# EasyEDA Pro project ADDA.eprj

# Schematic Schematic1
Board Name: Board1; Create Date: 2025-06-09
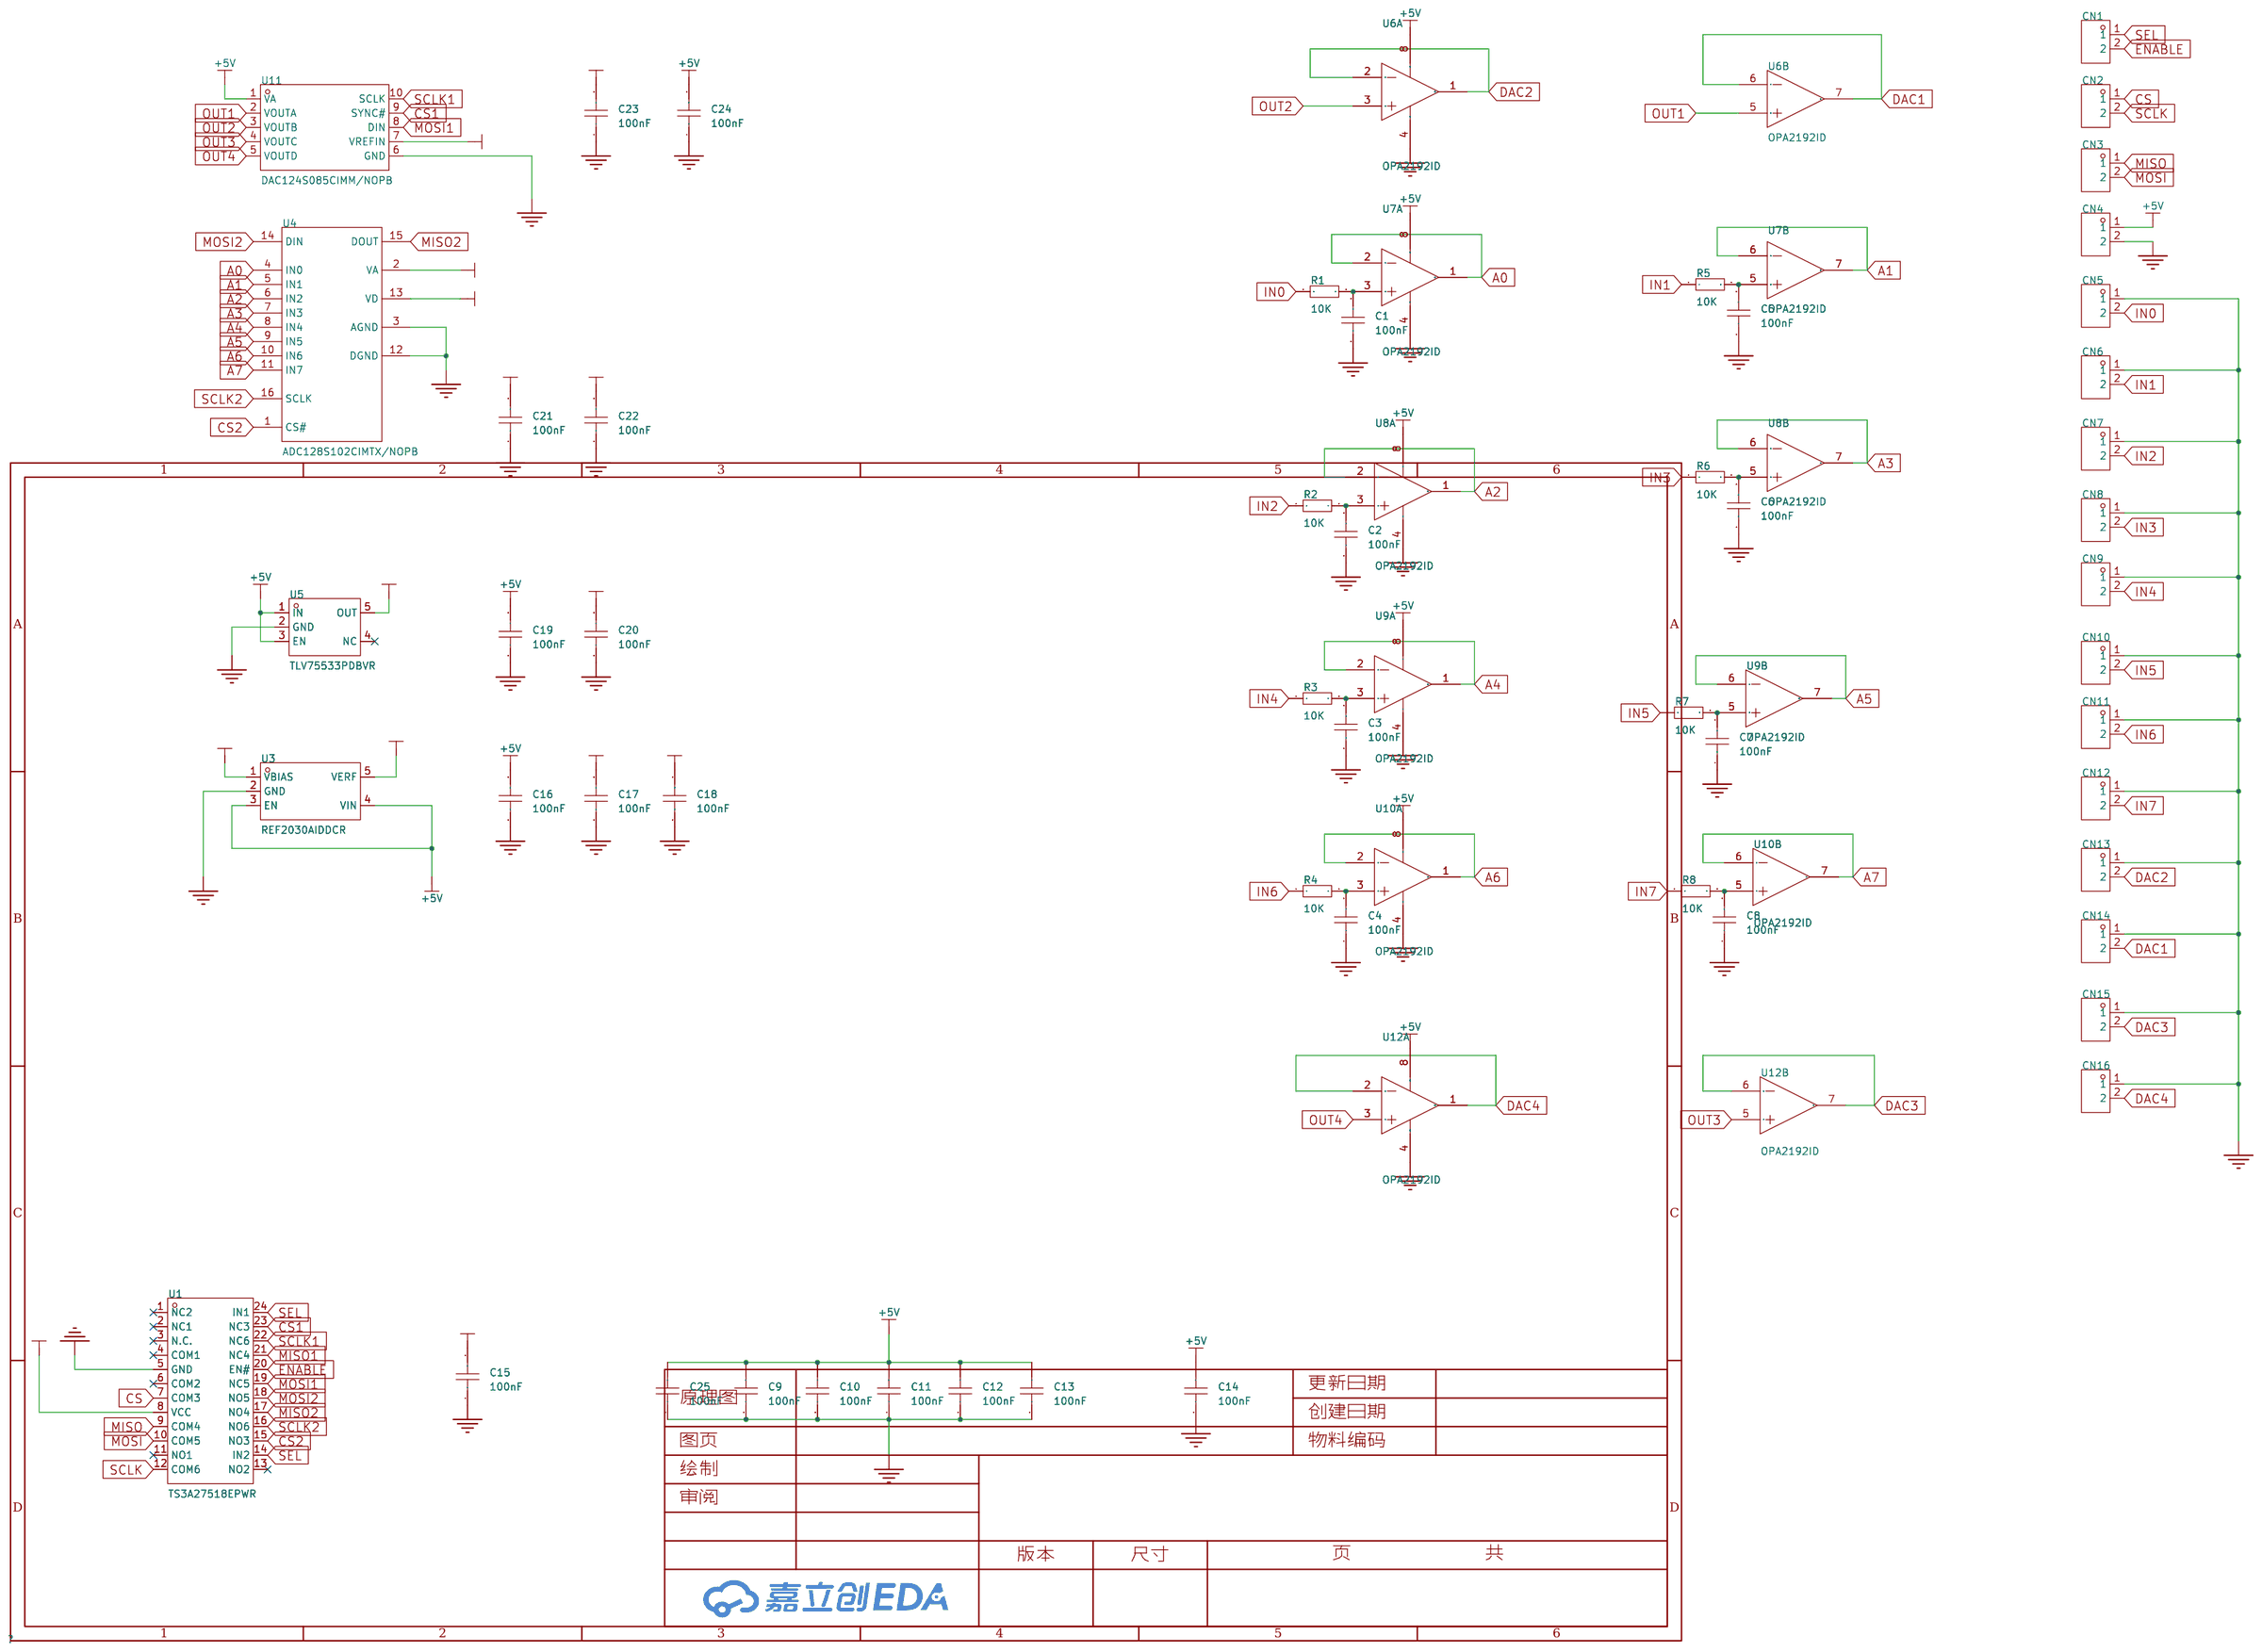
[diagram p0: schematic sheet]

## Parts
C1  100nF  [C0805]
C2  100nF  [C0805]
C3  100nF  [C0805]
C4  100nF  [C0805]
C5  100nF  [C0805]
C6  100nF  [C0805]
C7  100nF  [C0805]
C8  100nF  [C0805]
C9  100nF  [C0805]
C10  100nF  [C0805]
C11  100nF  [C0805]
C12  100nF  [C0805]
C13  100nF  [C0805]
C14  100nF  [C0805]
C15  100nF  [C0805]
C16  100nF  [C0805]
C17  100nF  [C0805]
C18  100nF  [C0805]
C19  100nF  [C0805]
C20  100nF  [C0805]
C21  100nF  [C0805]
C22  100nF  [C0805]
C23  100nF  [C0805]
C24  100nF  [C0805]
C25  100nF  [C0805]
CN1  CON2-2.54*2P  [CONN-TH_2P-P2.54-V]
CN2  CON2-2.54*2P  [CONN-TH_2P-P2.54-V]
CN3  CON2-2.54*2P  [CONN-TH_2P-P2.54-V]
CN4  CON2-2.54*2P  [CONN-TH_2P-P2.54-V]
CN5  CON2-2.54*2P  [CONN-TH_2P-P2.54-V]
CN6  CON2-2.54*2P  [CONN-TH_2P-P2.54-V]
CN7  CON2-2.54*2P  [CONN-TH_2P-P2.54-V]
CN8  CON2-2.54*2P  [CONN-TH_2P-P2.54-V]
CN9  CON2-2.54*2P  [CONN-TH_2P-P2.54-V]
CN10  CON2-2.54*2P  [CONN-TH_2P-P2.54-V]
CN11  CON2-2.54*2P  [CONN-TH_2P-P2.54-V]
CN12  CON2-2.54*2P  [CONN-TH_2P-P2.54-V]
CN13  CON2-2.54*2P  [CONN-TH_2P-P2.54-V]
CN14  CON2-2.54*2P  [CONN-TH_2P-P2.54-V]
CN15  CON2-2.54*2P  [CONN-TH_2P-P2.54-V]
CN16  CON2-2.54*2P  [CONN-TH_2P-P2.54-V]
R1  10K  [R0805]
R2  10K  [R0805]
R3  10K  [R0805]
R4  10K  [R0805]
R5  10K  [R0805]
R6  10K  [R0805]
R7  10K  [R0805]
R8  10K  [R0805]
U1  TS3A27518EPWR  [TSSOP-24_L7.8-W4.4-P0.65-LS6.4-BL]
U3  REF2030AIDDCR  [SOT-23-5_L2.9-W1.6-P0.95-LS2.8-BL]
U4  ADC128S102CIMTX/NOPB  [TSSOP-16_L5.0-W4.4-P0.65-LS6.4-BL]
U5  TLV75533PDBVR  [SOT-23-5_L3.0-W1.7-P0.95-LS2.8-BR]
U6  OPA2192ID  [SOIC-8_L4.9-W3.9-P1.27-LS6.0-BL]  (sections 1,2)
U7  OPA2192ID  [SOIC-8_L4.9-W3.9-P1.27-LS6.0-BL]  (sections 1,2)
U8  OPA2192ID  [SOIC-8_L4.9-W3.9-P1.27-LS6.0-BL]  (sections 1,2)
U9  OPA2192ID  [SOIC-8_L4.9-W3.9-P1.27-LS6.0-BL]  (sections 1,2)
U10  OPA2192ID  [SOIC-8_L4.9-W3.9-P1.27-LS6.0-BL]  (sections 1,2)
U11  DAC124S085CIMM/NOPB  [VSSOP-10_L3.0-W3.0-P0.50-LS4.9-BL]
U12  OPA2192ID  [SOIC-8_L4.9-W3.9-P1.27-LS6.0-BL]  (sections 1,2)

## Library data of the parts
C1-C25 = CAP_0805: Supplier Footprint: 0805
CN1-CN16 = CON2-2.54*2P: Supplier Part: C9900003238; Supplier Footprint: TH-2P; JLCPCB Part Class: Extended Part; Supplier: LCSC
R1-R8 = Res_0805: Supplier Footprint: 0805
U1 = TS3A27518EPWR: LCSC Part Name: TS3A27518E 6通道 (qSPI), 1:2 多路复用器/解复用器，集成IEC L-4 ESD 和1.8-V逻辑兼容控制输入; Supplier Part: C443721; Manufacturer: TI(德州仪器); Supplier Footprint: TSSOP-24; JLCPCB Part Class: 扩展库; Datasheet: https://www.ti.com/cn/lit/gpn/ts3a27518e; Supplier: LCSC; Number of Channels: 6; Voltage - Supply: 1.65V~3.6V; RDS(on): 6.2Ω
U3 = REF2030AIDDCR: 输出类型:固定;输入电压:3.02V~5.5V;输出电压:1.5V；3V;输出电流:20mA;精度:±0.05%;; Supplier Part: C528704; Manufacturer: TI(德州仪器); Supplier Footprint: SOT-23-5; JLCPCB Part Class: 扩展库; Datasheet: https://www.ti.com/cn/lit/gpn/ref2030; Supplier: LCSC; Output Type: 固定; Input Voltage: 3.02V~5.5V; Output Voltage: 1.5V；3V; Output Current: 20mA; Tolerance: ±0.05%; Temperature Coefficient: 8ppm/℃; Reference Type: 串联; Supply Current: 460uA; Noise - 1/10Hz to 10Hz: 12ppmp-p; Operating Temperature: -40℃~+125℃@(Ta)
U4 = ADC128S102CIMTX/NOPB: Supplier Part: C179666; Manufacturer: TI(德州仪器); Supplier Footprint: TSSOP-16; JLCPCB Part Class: 扩展库; Datasheet: https://www.ti.com/cn/lit/gpn/adc128s102; Supplier: LCSC; Interface: SPI；DSP; number of channels: 8; Supply Voltage: 2.7V~5.25V; sampling frequency: 1MHz; resolution: 12位; Operating Temperature: -40℃~+105℃
U5 = TLV75533PDBVR: LCSC Part Name: 具有使能功能的 500mA、高 PSRR、低 IQ、低压降稳压器; Supplier Part: C404027; Manufacturer: TI(德州仪器); Supplier Footprint: SOT-23-5; JLCPCB Part Class: 扩展库; Datasheet: https://www.ti.com/cn/lit/gpn/tlv755p; Supplier: LCSC; Output Type: 固定; Maximum Input Voltage: 5.5V; Output Voltage: 3.3V; Output Current: 500mA; Power Supply Rejection Ratio (PSRR): 52dB; Dropout Voltage: 238mV@(500mA); standby current: 31uA; Feature: 防静电保护；浪涌保护；低ESR；热保护(TSD)；欠压闭锁；过流保护(OCP)；带使能; Operating Temperature: -40℃~+125℃@(Tj); Output Polarity: 正极; Number of Outputs: 1
U6-U10 U12 = OPA2192ID: Supplier Part: C1346108; Manufacturer: TI(德州仪器); Supplier Footprint: SOIC-8; JLCPCB Part Class: 扩展库; Datasheet: https://www.ti.com/cn/lit/gpn/opa192; Supplier: LCSC; Number of Circuits: 双路; Gain Bandwidth Product(GBP): 10MHz; Current - Input Bias(Ib): 5pA; Voltage - Input Offset(Vos): 5uV; Common Mode Rejection Ratio (CMRR): 140dB; Slew Rate(SR): 20V/us; Supply Voltage: 4.5V~36V; Operating Temperature: -40℃~+125℃
U11 = DAC124S085CIMM/NOPB: Supplier Part: C529295; Manufacturer: TI(德州仪器); Supplier Footprint: VSSOP-10-0.5mm; JLCPCB Part Class: 扩展库; Datasheet: https://www.ti.com/cn/lit/gpn/dac124s085; Supplier: LCSC; Resolution(Bits): 12位; Number of Channels: 4; Interface: SPI；QSPI；MICROWIRE; Voltage - Supply: 2.7V~5.5V; Settling Time: 8.5us; INL/DNL(LSB): 8LSB; Operating Temperature: -40℃~+105℃

## Nets
1.5V: C17.2 U3.1(VBIAS)
3.3V: C15.2 C20.2 C21.2 U1.8(VCC) U4.13(VD) U5.5(OUT)
3V: C18.2 C22.2 C23.2 U3.5(VERF) U4.2(VA) U11.7(VREFIN)
+5V: C9.2 C10.2 C11.2 C12.2 C13.2 C14.2 C16.2 C19.2 C24.2 C25.2 CN4.1 U3.3(EN) U3.4(VIN) U5.1(IN) U5.3(EN) U6.8(VCC) U7.8(VCC) U8.8(VCC) U9.8(VCC) U10.8(VCC) U11.1(VA) U12.8(VCC)
GND: C1.1 C2.1 C3.1 C4.1 C5.1 C6.1 C7.1 C8.1 C9.1 C10.1 C11.1 C12.1 C13.1 C14.1 C15.1 C16.1 C17.1 C18.1 C19.1 C20.1 C21.1 C22.1 C23.1 C24.1 C25.1 CN4.2 CN5.1 CN6.1 CN7.1 CN8.1 CN9.1 CN10.1 CN11.1 CN12.1 CN13.1 CN14.1 CN15.1 CN16.1 U1.5(GND) U3.2(GND) U4.3(AGND) U4.12(DGND) U5.2(GND) U6.4(GND) U7.4(GND) U8.4(GND) U9.4(GND) U10.4(GND) U11.6(GND) U12.4(GND)
A0: U4.4(IN0) U7.1(OUT1) U7.2(IN1-)
A1: U4.5(IN1) U7.6(IN2-) U7.7(OUT2)
A2: U4.6(IN2) U8.1(OUT1) U8.2(IN1-)
A3: U4.7(IN3) U8.6(IN2-) U8.7(OUT2)
A4: U4.8(IN4) U9.1(OUT1) U9.2(IN1-)
A5: U4.9(IN5) U9.6(IN2-) U9.7(OUT2)
A6: U4.10(IN6) U10.1(OUT1) U10.2(IN1-)
A7: U4.11(IN7) U10.6(IN2-) U10.7(OUT2)
CS: CN2.1 U1.7(COM3)
CS1: U1.23(NC3) U11.9(SYNC#)
CS2: U1.15(NO3) U4.1(CS#)
DAC1: CN14.2 U6.6(IN2-) U6.7(OUT2)
DAC2: CN13.2 U6.1(OUT1) U6.2(IN1-)
DAC3: CN15.2 U12.6(IN2-) U12.7(OUT2)
DAC4: CN16.2 U12.1(OUT1) U12.2(IN1-)
ENABLE: CN1.2 U1.20(EN#)
IN0: CN5.2 R1.1
IN1: CN6.2 R5.1
IN2: CN7.2 R2.1
IN3: CN8.2 R6.1
IN4: CN9.2 R3.1
IN5: CN10.2 R7.1
IN6: CN11.2 R4.1
IN7: CN12.2 R8.1
MISO: CN3.1 U1.9(COM4)
MISO1: U1.21(NC4)
MISO2: U1.17(NO4) U4.15(DOUT)
MOSI: CN3.2 U1.10(COM5)
MOSI1: U1.19(NC5) U11.8(DIN)
MOSI2: U1.18(NO5) U4.14(DIN)
OUT1: U6.5(IN2+) U11.2(VOUTA)
OUT2: U6.3(IN1+) U11.3(VOUTB)
OUT3: U11.4(VOUTC) U12.5(IN2+)
OUT4: U11.5(VOUTD) U12.3(IN1+)
SCLK: CN2.2 U1.12(COM6)
SCLK1: U1.22(NC6) U11.10(SCLK)
SCLK2: U1.16(NO6) U4.16(SCLK)
SEL: CN1.1 U1.14(IN2) U1.24(IN1)
$1N6538: C1.2 R1.2 U7.3(IN1+)
$1N6729: C5.2 R5.2 U7.5(IN2+)
$1N6815: C2.2 R2.2 U8.3(IN1+)
$1N6901: C6.2 R6.2 U8.5(IN2+)
$1N6987: C3.2 R3.2 U9.3(IN1+)
$1N7073: C7.2 R7.2 U9.5(IN2+)
$1N7159: C4.2 R4.2 U10.3(IN1+)
$1N7245: C8.2 R8.2 U10.5(IN2+)

Not connected (* = marked no-connect by the designer): U1 1(NC2)* 2(NC1)* 3(N.C.)* 4(COM1)* 6(COM2)* 11(NO1)* 13(NO2)*; U5 4(NC)*

# Board PCB1
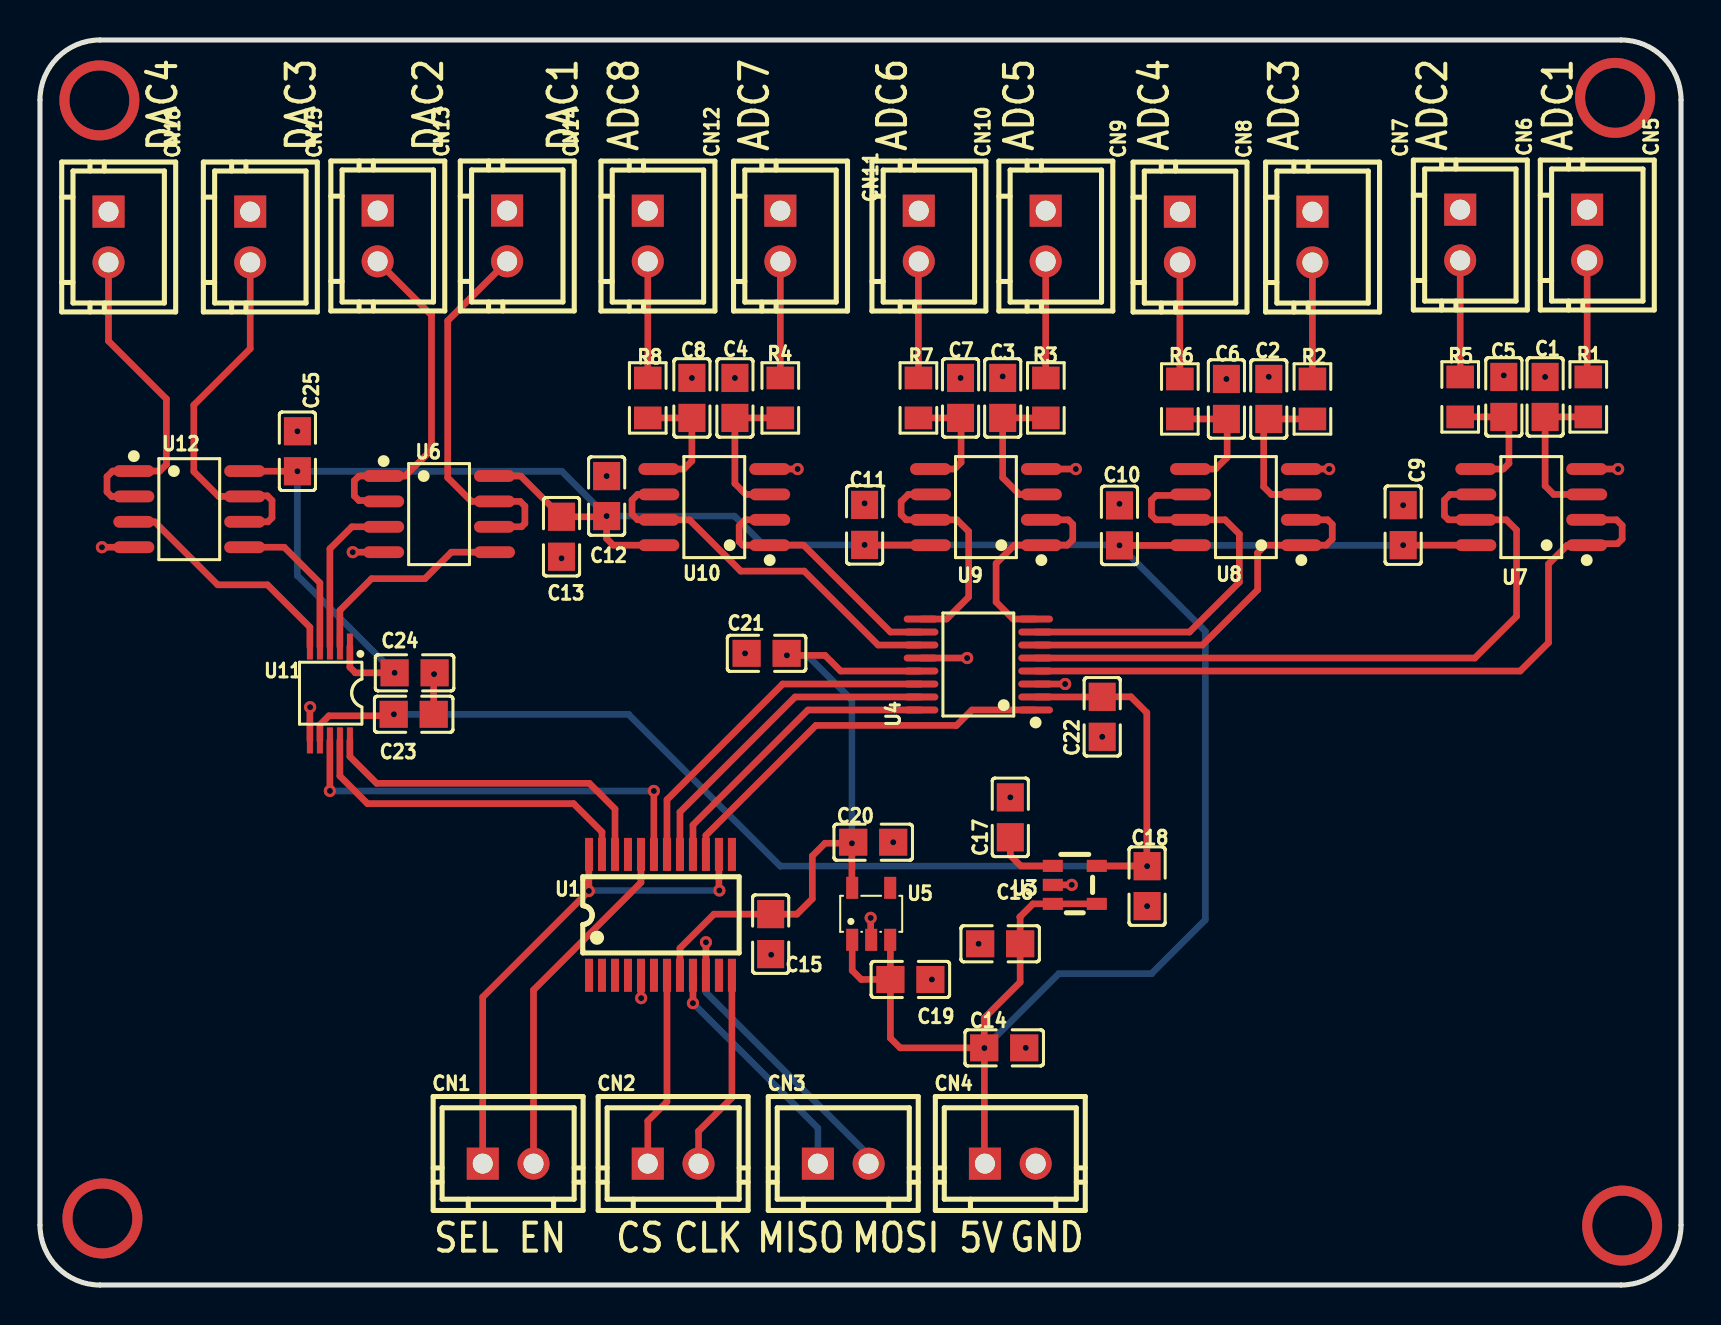
[diagram p1: board, top side]
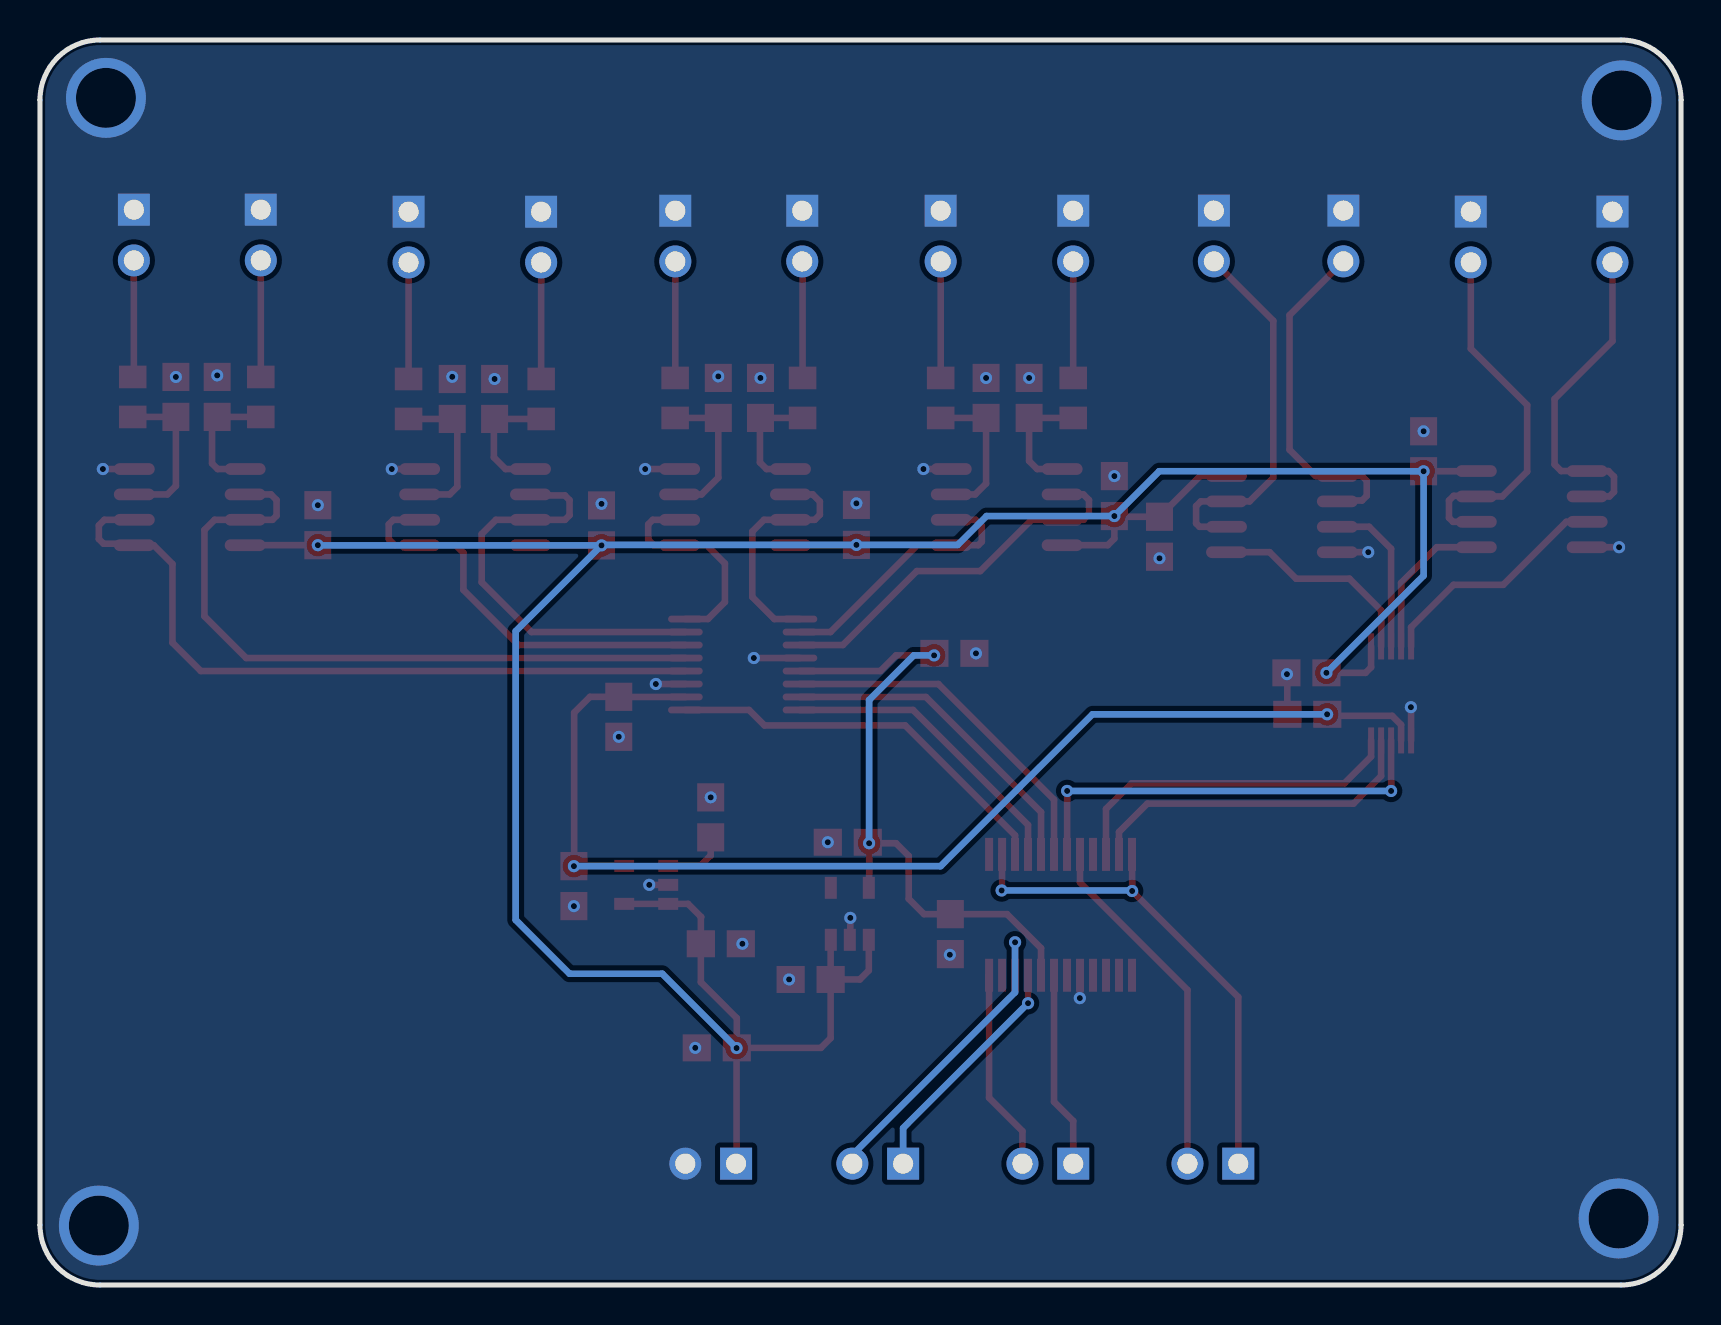
[diagram p2: board, bottom side, seen from below]

Outline 82.09 x 62.28 mm; copper layers: Top Layer, Bottom Layer. Coordinates in mm from the lower left corner of the outline.
Outline path: 0,59.28 0,3 arc(0.88,0.88) 3,0 79.09,0 arc(81.21,0.88) 82.09,3 82.09,59.28 arc(81.21,61.4) 79.09,62.28 3,62.28 arc(0.88,61.4) 0,59.28
Stack: Top Layer 0.035mm / Dielectric1 1.51mm FR4 er 4.5 / Bottom Layer 0.035mm

## Design rules (mm)
template: 自定义配置
spacing copperThickness1oz (default): track to track 0.102, other pairs 0.152 to 0.3
spacing copperThickness2oz: track to track 0.203, other pairs 0.152 to 0.3
track width copperThickness1oz (default): min 0.127, default 0.254, max 2.54
track width copperThickness2oz: min 0.203, default 0.254, max 2.54
differential pair differentialPair (default): width min 0.127, default 0.254, max 2.54; gap min 0.152, default 0.152
via viaSize (default): diameter min 0.5, default 0.61, max 10; hole min 0.3, default 0.305, max 6.3

## Placement (name value [footprint] x y rotation side)
C1  100nF  [C0805]  75.29 44.43 270 top
C2  100nF  [C0805]  61.47 44.32 270 top
C3  100nF  [C0805]  48.16 44.38 270 top
C4  100nF  [C0805]  34.76 44.38 270 top
C5  100nF  [C0805]  73.23 44.43 270 top
C6  100nF  [C0805]  59.35 44.32 270 top
C7  100nF  [C0805]  46.05 44.38 270 top
C8  100nF  [C0805]  32.61 44.38 270 top
C9  100nF  [C0805]  68.19 38.01 270 top
C10  100nF  [C0805]  54 38 270 top
C11  100nF  [C0805]  41.25 38.03 270 top
C12  100nF  [C0805]  28.35 39.47 270 top
C13  100nF  [C0805]  26.09 37.43 90 top
C14  100nF  [C0805]  48.23 11.86 180 top
C15  100nF  [C0805]  36.55 17.55 90 top
C16  100nF  [C0805]  48.03 17.07 0 top
C17  100nF  [C0805]  48.54 23.39 270 top
C18  100nF  [C0805]  55.38 19.95 90 top
C19  100nF  [C0805]  43.54 15.28 180 top
C20  100nF  [C0805]  41.68 22.15 180 top
C21  100nF  [C0805]  36.35 31.6 0 top
C22  100nF  [C0805]  53.14 28.42 90 top
C23  100nF  [C0805]  18.69 28.55 180 top
C24  100nF  [C0805]  18.74 30.62 180 top
C25  100nF  [C0805]  12.88 41.71 270 top
CN1  CON2-2.54*2P  [CONN-TH_2P-P2.54-V]  23.42 6.07 0 top
CN2  CON2-2.54*2P  [CONN-TH_2P-P2.54-V]  31.67 6.07 0 top
CN3  CON2-2.54*2P  [CONN-TH_2P-P2.54-V]  40.18 6.07 0 top
CN4  CON2-2.54*2P  [CONN-TH_2P-P2.54-V]  48.54 6.07 0 top
CN5  CON2-2.54*2P  [CONN-TH_2P-P2.54-V]  77.39 52.52 270 top
CN6  CON2-2.54*2P  [CONN-TH_2P-P2.54-V]  71.04 52.52 270 top
CN7  CON2-2.54*2P  [CONN-TH_2P-P2.54-V]  63.65 52.42 270 top
CN8  CON2-2.54*2P  [CONN-TH_2P-P2.54-V]  57.02 52.42 270 top
CN9  CON2-2.54*2P  [CONN-TH_2P-P2.54-V]  50.31 52.47 270 top
CN10  CON2-2.54*2P  [CONN-TH_2P-P2.54-V]  43.96 52.47 270 top
CN11  CON2-2.54*2P  [CONN-TH_2P-P2.54-V]  37.04 52.47 270 top
CN12  CON2-2.54*2P  [CONN-TH_2P-P2.54-V]  30.41 52.47 270 top
CN13  CON2-2.54*2P  [CONN-TH_2P-P2.54-V]  16.89 52.48 270 top
CN14  CON2-2.54*2P  [CONN-TH_2P-P2.54-V]  23.37 52.48 270 top
CN15  CON2-2.54*2P  [CONN-TH_2P-P2.54-V]  10.52 52.43 270 top
CN16  CON2-2.54*2P  [CONN-TH_2P-P2.54-V]  3.43 52.43 270 top
R1  10K  [R0805]  77.45 44.43 270 top
R2  10K  [R0805]  63.65 44.32 270 top
R3  10K  [R0805]  50.32 44.38 270 top
R4  10K  [R0805]  37.03 44.38 270 top
R5  10K  [R0805]  71.04 44.43 270 top
R6  10K  [R0805]  57.02 44.32 270 top
R7  10K  [R0805]  43.94 44.38 270 top
R8  10K  [R0805]  30.4 44.38 270 top
U1  TS3A27518EPWR  [TSSOP-24_L7.8-W4.4-P0.65-LS6.4-BL]  31.04 18.52 0 top
U3  REF2030AIDDCR  [SOT-23-5_L2.9-W1.6-P0.95-LS2.8-BL]  51.77 20.02 270 top
U4  ADC128S102CIMTX/NOPB  [TSSOP-16_L5.0-W4.4-P0.65-LS6.4-BL]  46.94 31.04 90 top
U5  TLV75533PDBVR  [SOT-23-5_L3.0-W1.7-P0.95-LS2.8-BR]  41.58 18.57 270 top
U6  OPA2192ID  [SOIC-8_L4.9-W3.9-P1.27-LS6.0-BL]  19.96 38.56 270 top
U7  OPA2192ID  [SOIC-8_L4.9-W3.9-P1.27-LS6.0-BL]  74.6 38.91 90 top
U8  OPA2192ID  [SOIC-8_L4.9-W3.9-P1.27-LS6.0-BL]  60.33 38.91 90 top
U9  OPA2192ID  [SOIC-8_L4.9-W3.9-P1.27-LS6.0-BL]  47.32 38.91 90 top
U10  OPA2192ID  [SOIC-8_L4.9-W3.9-P1.27-LS6.0-BL]  33.73 38.91 90 top
U11  DAC124S085CIMM/NOPB  [VSSOP-10_L3.0-W3.0-P0.50-LS4.9-BL]  14.5 29.59 180 top
U12  OPA2192ID  [SOIC-8_L4.9-W3.9-P1.27-LS6.0-BL]  7.47 38.81 270 top

## Footprints (pads in the part's own frame, mm; a bottom-side part is the same pattern mirrored in y, then rotated)
C0805
  rect 1.41x1.35 smd: 1(-1,0) 2(1,0)
CONN-TH_2P-P2.54-V
  rect 1.6x1.6 hole 1: 1(-1.27,0)
  round 1.6 hole 1: 2(1.27,0)
R0805
  rect 1.133x1.377 smd: 1(-1,0) 2(1,0)
SOIC-8_L4.9-W3.9-P1.27-LS6.0-BL
  oval 0.588x2.045 smd: 1(-1.905,-2.772) 2(-0.635,-2.772) 3(0.635,-2.772) 4(1.905,-2.772) 5(1.905,2.772) 6(0.635,2.772) 7(-0.635,2.772) 8(-1.905,2.772)
SOT-23-5_L2.9-W1.6-P0.95-LS2.8-BL
  rect 0.6x1 smd: 1(-0.95,-1.1) 2(0,-1.1) 3(0.95,-1.1) 4(0.95,1.1) 5(-0.95,1.1)
SOT-23-5_L3.0-W1.7-P0.95-LS2.8-BR
  rect 1.1x0.6 smd: 1(1.3,-0.95) 2(1.3,0) 3(1.3,0.95) 4(-1.3,0.95) 5(-1.3,-0.95)
TSSOP-16_L5.0-W4.4-P0.65-LS6.4-BL
  oval 0.343x1.732 smd: 1(-2.275,-2.866) 2(-1.625,-2.866) 3(-0.975,-2.866) 4(-0.325,-2.866) 5(0.325,-2.866) 6(0.975,-2.866) 7(1.625,-2.866) 8(2.275,-2.866) 9(2.275,2.866) 10(1.625,2.866) 11(0.975,2.866) 12(0.325,2.866) 13(-0.325,2.866) 14(-0.975,2.866) 15(-1.625,2.866) 16(-2.275,2.866)
TSSOP-24_L7.8-W4.4-P0.65-LS6.4-BL
  rect 0.4x1.65 smd: 1(-3.575,-3.022) 2(-2.925,-3.022) 3(-2.275,-3.022) 4(-1.625,-3.022) 5(-0.975,-3.022) 6(-0.325,-3.022) 7(0.325,-3.022) 8(0.975,-3.022) 9(1.625,-3.022) 10(2.275,-3.022) 11(2.925,-3.022) 12(3.575,-3.022) 13(3.575,3.022) 14(2.925,3.022) 15(2.275,3.022) 16(1.625,3.022) 17(0.975,3.022) 18(0.325,3.022) 19(-0.325,3.022) 20(-0.975,3.022) 21(-1.625,3.022) 22(-2.275,3.022) 23(-2.925,3.022) 24(-3.575,3.022)
VSSOP-10_L3.0-W3.0-P0.50-LS4.9-BL
  rect 0.3x1.3 smd: 1(-1,-2.35) 2(-0.5,-2.35) 3(0,-2.35) 4(0.5,-2.35) 5(1,-2.35) 6(1,2.35) 7(0.5,2.35) 8(0,2.35) 9(-0.5,2.35) 10(-1,2.35)

## Nets
As in the schematic.

Pads without a net: U1 1 2 3 4 6 11 13; U5 4

## Via types
v1: diameter 0.61, hole 0.305, Top Layer to Bottom Layer, 53 vias
v2: diameter 4, hole 3, Top Layer to Bottom Layer, 4 vias

## Routing (per net, layer and track width the routed paths; a pad name or vN(x,y) marks a point on that pad's centre or on a via; arc(x,y) is an arc through that point)
1.5V: length 3.2
  Top Layer w0.33: C17.2 48.54,21.49 49.06,20.97 U3.1
3.3V: length 34
  Top Layer w0.33: v1(37.36,31.5) 39.27,31.5 40.05,30.72 U4.13 ; U5.5 40.61,19.88 v1(40.61,22.1) 39.27,22.1 38.63,21.46 38.63,19.32 37.87,18.55 C15.2 33.71,18.55 32.01,16.85 U1.8
  Bottom Layer w0.33: v1(40.61,22.1) 40.61,29.26 38.38,31.5 v1(37.36,31.5)
3V: length 61.6
  Top Layer w0.33: U4.2 53.13,29.42 C22.2 54.58,29.42 55.37,28.63 55.37,20.97 U3.5 ; U11.7 14,28.03 14.45,28.47 17.62,28.47 C23.2
  Bottom Layer w0.33: v1(17.7,28.55) 29.44,28.55 37.04,20.95 v1(55.38,20.95)
+5V: length 160.7
  Top Layer w0.33: v1(68.19,37.01) U7.8 ; U3.4 U3.3 49.67,19.07 49.02,18.41 49.03,18.4 C16.2 49.03,15.15 47.23,13.35 C14.2 ; U11.1 15.5,30.9 15.78,30.62 v1(17.74,30.62) ; CN4.1 47.24,6.1 v1(47.24,11.85) C14.2 ; 10.24,40.72 10.25,40.71 v1(12.88,40.71) ; C14.2 43.03,11.86 42.54,12.35 C19.2 ; U5.1 40.63,15.73 41.08,15.28 C19.2 ; U6.8 24.05,40.47 C13.2 28.31,38.43 v1(28.35,38.47) 28.35,37.34 28.68,37.01 U10.8 ; U9.8 41.27,37.01 v1(41.25,37.03) ; v1(54,37) 57.54,37 U8.8 ; C19.2 42.54,17.26 U5.3
  Bottom Layer w0.33: v1(68.19,37.01) 68.18,37 v1(54,37) ; v1(54,37) 53.98,37.03 v1(41.25,37.03) 36.18,37.03 34.74,38.47 v1(28.35,38.47) 26.1,40.71 v1(12.88,40.71) 12.88,35.49 v1(17.74,30.62) ; v1(54,37) 58.29,32.71 58.29,18.26 55.6,15.57 50.96,15.57 v1(47.24,11.85)
GND: length 20
  Top Layer w0.33: U4.3 v1(51.28,30.07) ; 19.71,30.6 v1(19.71,30.56) ; 19.71,30.6 19.69,30.58 C23.1 ; 19.71,30.6 C24.1 ; 17.19,36.66 v1(15.65,36.66) ; U7.4 v1(78.94,40.82) ; U4.12 v1(46.38,31.37) ; v1(30.07,14.35) 30.06,14.36 U1.5 ; U11.6 13.5,28.9 v1(13.51,28.91) ; U12.4 v1(3.1,36.91) ; U8.4 v1(64.49,40.82) ; U5.2 41.55,17.29 v1(41.55,18.37) ; U3.2 v1(51.61,20.02) ; U9.4 v1(51.82,40.82) ; U10.4 v1(37.9,40.82)
  vias: v1(12.88,42.71) v1(26.09,36.35) v1(28.35,40.47) v1(32.61,45.38) v1(34.76,45.38) v1(35.27,31.6) v1(36.58,16.52) v1(41.25,39.1) v1(42.68,22.15) v1(44.62,15.28) v1(46.05,45.38) v1(46.95,17.07) v1(48.16,45.45) v1(48.54,24.39) v1(49.31,11.86) v1(53.14,27.42) v1(54,39.08) v1(55.38,18.95) v1(59.35,45.32) v1(61.47,45.43) v1(68.19,39.01) v1(73.23,45.5) v1(75.29,45.43) v2(2.97,59.26) v2(3.12,3.33) v2(78.79,59.39) v2(79.15,2.97)
A0: length 37
  Top Layer w0.33: U4.4 74.05,30.72 75.46,32.13 75.46,36.07 76.4,37.01 U7.1 77.45,37.09 78.91,37.09 79.15,37.32 79.15,38 78.87,38.28 U7.2
A1: length 35.6
  Top Layer w0.33: U7.6 70.54,39.55 70.26,39.27 70.26,38.48 70.46,38.28 U7.7 73.36,38.28 73.86,37.77 73.86,33.45 71.77,31.37 U4.5
A2: length 20.5
  Top Layer w0.33: U8.2 64.41,38.28 64.64,38.05 64.64,37.31 64.34,37.01 U8.1 61.29,37.01 60.91,36.63 60.91,34.77 58.15,32.02 U4.6
A3: length 21.2
  Top Layer w0.33: U4.7 57.51,32.67 59.99,35.15 59.99,37.57 59.28,38.28 U8.7 55.83,38.28 55.6,38.51 55.6,39.26 55.83,39.5 57.5,39.5 U8.6
A4: length 11
  Top Layer w0.33: U9.2 51.44,38.28 51.66,38.05 51.66,37.29 51.38,37.01 U9.1 48.74,37.01 47.83,36.09 47.83,34.16 48.68,33.32 U4.8
A5: length 12.1
  Top Layer w0.33: U4.9 45.35,33.32 46.46,34.42 46.46,37.69 45.87,38.28 U9.7 43.33,38.28 43.08,38.53 43.08,39.19 43.43,39.55 U9.6
A6: length 13.4
  Top Layer w0.33: U10.2 35.28,38.28 34.98,37.97 34.98,37.19 35.15,37.01 U10.1 38.2,37.01 42.55,32.67 U4.10
A7: length 19.3
  Top Layer w0.33: U4.11 41.93,32.02 38.23,35.71 35.05,35.71 32.49,38.28 U10.7 29.9,38.28 29.62,38.56 29.62,39.27 29.9,39.55 U10.6
CS: length 9.8
  Top Layer w0.33: CN2.1 30.4,8.21 31.36,9.17 U1.7
CS1: length 17.2
  Top Layer w0.33: 28.11,21.54 28.11,22.66 26.7,24.08 16.38,24.08 15,25.46 U11.9
CS2: length 20
  Top Layer w0.33: U4.1 46.62,28.77 45.85,27.99 38.81,27.99 33.31,22.49 33.31,21.54
DAC1: length 19
  Top Layer w0.33: CN14.2 20.4,48.24 20.4,40.39 21.58,39.2 U6.7 24.02,39.2 24.26,38.96 24.26,38.1 24.09,37.93 U6.6
DAC2: length 17.4
  Top Layer w0.33: CN13.2 19.58,48.52 19.58,41.78 18.27,40.47 15.96,40.47 15.72,40.23 15.72,39.48 15.96,39.24 17.15,39.24 17.19,39.2
DAC3: length 18.5
  Top Layer w0.33: CN15.2 10.52,46.84 7.7,44.02 7.7,40.69 8.94,39.45 10.24,39.45 10.27,39.48 11.37,39.48 11.61,39.24 11.61,38.38 11.4,38.18 10.24,38.18
DAC4: length 16.5
  Top Layer w0.33: 3.43,50.9 3.43,47.22 6.32,44.32 6.32,41.05 5.99,40.72 U12.1 3.63,40.72 3.35,40.44 3.35,39.68 3.58,39.45 U12.2
ENABLE: length 17.7
  Top Layer w0.33: 30.06,21.54 30.06,20.13 24.69,14.76 CN1.2
IN0: length 5.9
  Top Layer w0.33: 77.39,51.25 77.39,45.48 R1.1
IN1: length 5.8
  Top Layer w0.33: R5.1 71.04,51.25
IN2: length 5.8
  Top Layer w0.33: R2.1 CN7.2
IN3: length 5.8
  Top Layer w0.33: CN8.2 57.02,45.33
IN4: length 5.8
  Top Layer w0.33: R3.1 50.31,45.38 CN9.2
IN5: length 5.8
  Top Layer w0.33: R7.1 43.94,51.19 CN10.2
IN6: length 5.8
  Top Layer w0.33: CN11.2 37.03,51.2 R4.1
IN7: length 5.8
  Top Layer w0.33: CN12.2 30.41,45.38
MISO: length 12
  Top Layer w0.33: U1.9 v1(32.66,14.1)
  Bottom Layer w0.33: CN3.1 38.91,7.85 v1(32.66,14.1)
MISO2: length 16.6
  Top Layer w0.33: U4.15 37.77,29.42 32.01,23.66 32.01,21.54
MOSI: length 16.1
  Top Layer w0.33: U1.10 v1(33.31,17.15)
  Bottom Layer w0.33: v1(33.31,17.15) 33.31,14.64 41.45,6.5 CN3.2
MOSI1: length 21.9
  Top Layer w0.33: 30.71,21.54 30.71,21.55 v1(30.71,24.72) ; U11.8 v1(14.5,24.72)
  Bottom Layer w0.33: v1(14.5,24.72) v1(30.71,24.72)
MOSI2: length 17.8
  Top Layer w0.33: 31.36,21.54 31.36,24.28 37.15,30.07 U4.14
OUT1: length 10.7
  Top Layer w0.33: U11.2 15,33.75 16.59,35.33 19.25,35.33 20.58,36.66 U6.5
OUT2: length 8
  Top Layer w0.33: U11.3 14.5,36.83 15.6,37.93 17.19,37.93
OUT3: length 7.7
  Top Layer w0.33: 10.24,36.91 12.22,36.91 14,35.12 U11.4
OUT4: length 12
  Top Layer w0.33: U11.5 13.5,32.9 11.38,35.03 8.89,35.03 5.74,38.18 U12.3
SCLK: length 10.1
  Top Layer w0.33: U1.12 34.61,9.37 32.94,7.7 CN2.2
SCLK1: length 17.4
  Top Layer w0.33: U11.10 15.5,26.43 16.84,25.1 27.48,25.1 28.76,23.82 28.76,21.54
SCLK2: length 15.3
  Top Layer w0.33: U4.16 38.42,28.77 32.66,23.01 32.66,21.54
SEL: length 26
  Top Layer w0.33: v1(33.98,19.74) 33.96,19.76 33.96,21.54 ; CN1.1 22.15,14.4 v1(27.46,19.71) 27.46,21.53 27.46,21.54
  Bottom Layer w0.33: v1(27.46,19.71) 27.48,19.74 v1(33.98,19.74)
$1N6538: length 7.9
  Top Layer w0.33: U7.3 75.72,39.55 75.29,39.97 C1.2 R1.2
$1N6729: length 6.4
  Top Layer w0.33: R5.2 C5.2 73.48,43.17 73.48,41.1 73.2,40.82 U7.5
$1N6815: length 7.7
  Top Layer w0.33: R2.2 C2.2 61.21,43.07 61.21,39.93 61.6,39.55 U8.3
$1N6901: length 6.3
  Top Layer w0.33: U8.5 58.8,40.82 59.39,41.4 59.39,43.29 C6.2 R6.2
$1N6987: length 7.4
  Top Layer w0.33: R3.2 C3.2 48.16,40.39 49,39.55 U9.3
$1N7073: length 6
  Top Layer w0.33: R7.2 C7.2 46.08,43.35 46.08,41.15 45.74,40.82 U9.5
$1N7159: length 7.5
  Top Layer w0.33: R4.2 C4.2 34.76,40.09 35.31,39.55 U10.3
$1N7245: length 6.2
  Top Layer w0.33: U10.5 32.21,40.82 32.61,41.22 C8.2 R8.2

## Copper pours and planes (outline as drawn; the poured copper is in the pictures)
GND on Bottom Layer: -0.23,64.11 81.91,64.11 81.91,0.03 -0.23,0.03

## Text on the board
Top Silkscreen Layer: SEL | EN | CS | CLK | MISO | MOSI | 5V | GND | DAC4 | DAC3 | DAC2 | DAC1 | ADC8 | ADC7 | ADC6 | ADC5 | ADC4 | ADC3 | ADC2 | ADC1
